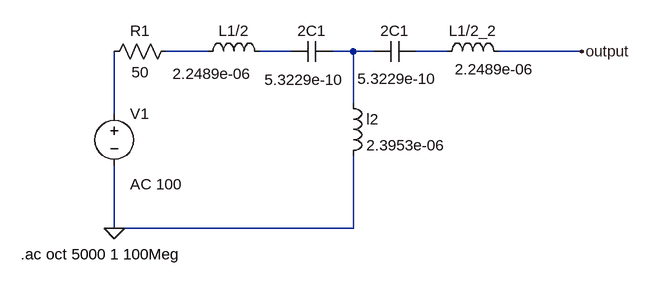
[diagram p0: schematic filtrPasmowoprzepustowyTypuT.asc]
filtrPasmowoprzepustowyTypuT.asc, the LTspice schematic file:
Version 4
SHEET 1 880 680
WIRE -160 -112 -224 -112
WIRE -32 -112 -80 -112
WIRE 64 -112 32 -112
WIRE 96 -112 64 -112
WIRE 208 -112 160 -112
WIRE 416 -112 288 -112
WIRE 64 -32 64 -112
WIRE -304 -16 -304 -112
WIRE -304 160 -304 64
WIRE 64 160 64 48
WIRE 64 160 -304 160
FLAG -304 160 0
FLAG 416 -112 output
SYMBOL voltage -304 -32 R0
WINDOW 123 24 124 Left 2
WINDOW 39 0 0 Left 0
SYMATTR Value2 AC 100
SYMATTR InstName V1
SYMATTR Value ""
SYMBOL res -208 -128 R90
WINDOW 0 0 56 VBottom 2
WINDOW 3 32 56 VTop 2
SYMATTR InstName R1
SYMATTR Value 50
SYMBOL ind -176 -96 R270
WINDOW 0 32 56 VTop 2
WINDOW 3 -3 23 VBottom 2
SYMATTR InstName L1/2
SYMATTR Value 2.2489e-06
SYMBOL ind 192 -96 R270
WINDOW 0 32 56 VTop 2
WINDOW 3 4 90 VBottom 2
SYMATTR InstName L1/2_2
SYMATTR Value 2.2489e-06
SYMBOL ind 48 -48 R0
SYMATTR InstName l2
SYMATTR Value 2.3953e-06
SYMBOL cap 32 -128 R90
WINDOW 0 0 32 VBottom 2
WINDOW 3 44 43 VTop 2
SYMATTR InstName 2C1
SYMATTR Value 5.3229e-10
SYMBOL cap 160 -128 R90
WINDOW 0 0 32 VBottom 2
WINDOW 3 42 28 VTop 2
SYMATTR InstName 2C1
SYMATTR Value 5.3229e-10
TEXT -448 200 Left 2 !.ac oct 5000 1 100Meg

The netlist it stands for:
* filtrPasmowoprzepustowyTypuT.asc
V1 N005 0 AC 100
R1 N001 N005 50
L1/2 N001 N002 2.2489e-06
L1/2_2 N004 output 2.2489e-06
l2 N003 0 2.3953e-06
C§2C1 N003 N002 5.3229e-10
C§2C1 N004 N003 5.3229e-10
.ac oct 5000 1 100Meg
.backanno
.end